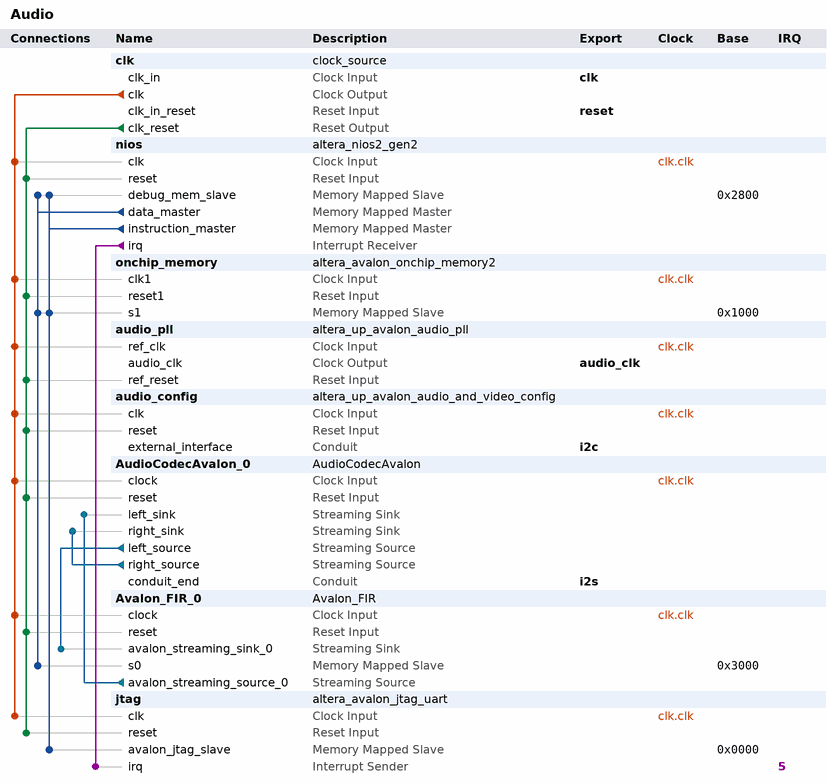
[diagram p0: system contents]
# Platform Designer (Qsys) system Audio, Cyclone V 5CSEMA5F31C6
# Parameters at their usual value, and those the tool derives, are not listed.
package require -exact qsys 16.1
create_system Audio
set_project_property DEVICE_FAMILY {Cyclone V}
set_project_property DEVICE 5CSEMA5F31C6

add_instance clk clock_source 16.1
set_instance_parameter_value clk clockFrequency 50000000

add_instance nios altera_nios2_gen2 16.1
set_instance_parameter_value nios dcache_size 2048
set_instance_parameter_value nios exceptionSlave onchip_memory.s1
set_instance_parameter_value nios icache_size 4096
set_instance_parameter_value nios impl Tiny
set_instance_parameter_value nios resetSlave onchip_memory.s1

add_instance onchip_memory altera_avalon_onchip_memory2 16.1
set_instance_parameter_value onchip_memory dataWidth 32
set_instance_parameter_value onchip_memory dualPort false
set_instance_parameter_value onchip_memory initMemContent true
set_instance_parameter_value onchip_memory initializationFileName onchip_mem.hex
set_instance_parameter_value onchip_memory memorySize 4096

add_instance audio_pll altera_up_avalon_audio_pll 16.1
set_instance_parameter_value audio_pll gui_refclk 50.0

add_instance audio_config altera_up_avalon_audio_and_video_config 16.1
set_instance_parameter_value audio_config audio_in {Line In to ADC}
set_instance_parameter_value audio_config bit_length 24
set_instance_parameter_value audio_config board DE1-SoC
set_instance_parameter_value audio_config line_in_bypass false
set_instance_parameter_value audio_config sampling_rate {48 kHz}

add_instance AudioCodecAvalon_0 AudioCodecAvalon 1.0
set_instance_parameter_value AudioCodecAvalon_0 gDataWidth 24
set_instance_parameter_value AudioCodecAvalon_0 gDataWidthLen 5

add_instance Avalon_FIR_0 Avalon_FIR 1.0
set_instance_parameter_value Avalon_FIR_0 gDataWidth 24
set_instance_parameter_value Avalon_FIR_0 gNrAddressLines 4

add_instance jtag altera_avalon_jtag_uart 16.1
set_instance_parameter_value jtag simInteractiveOptions NO_INTERACTIVE_WINDOWS

# connections
add_connection clk.clk audio_config.clk clock
add_connection clk.clk audio_pll.ref_clk clock
add_connection clk.clk AudioCodecAvalon_0.clock clock
add_connection clk.clk Avalon_FIR_0.clock clock
add_connection clk.clk jtag.clk clock
add_connection clk.clk nios.clk clock
add_connection clk.clk onchip_memory.clk1 clock
add_connection clk.clk_reset audio_config.reset reset
add_connection clk.clk_reset audio_pll.ref_reset reset
add_connection clk.clk_reset AudioCodecAvalon_0.reset reset
add_connection clk.clk_reset Avalon_FIR_0.reset reset
add_connection clk.clk_reset jtag.reset reset
add_connection clk.clk_reset nios.reset reset
add_connection clk.clk_reset onchip_memory.reset1 reset
add_connection nios.data_master Avalon_FIR_0.s0 avalon
set_connection_parameter_value nios.data_master/Avalon_FIR_0.s0 baseAddress 0x3000
add_connection nios.data_master nios.debug_mem_slave avalon
set_connection_parameter_value nios.data_master/nios.debug_mem_slave baseAddress 0x2800
add_connection nios.data_master onchip_memory.s1 avalon
set_connection_parameter_value nios.data_master/onchip_memory.s1 baseAddress 0x1000
add_connection nios.instruction_master jtag.avalon_jtag_slave avalon
set_connection_parameter_value nios.instruction_master/jtag.avalon_jtag_slave baseAddress 0x0000
add_connection nios.instruction_master nios.debug_mem_slave avalon
set_connection_parameter_value nios.instruction_master/nios.debug_mem_slave baseAddress 0x2800
add_connection nios.instruction_master onchip_memory.s1 avalon
set_connection_parameter_value nios.instruction_master/onchip_memory.s1 baseAddress 0x1000
add_connection AudioCodecAvalon_0.left_source Avalon_FIR_0.avalon_streaming_sink_0 avalon_streaming
add_connection AudioCodecAvalon_0.right_source AudioCodecAvalon_0.right_sink avalon_streaming
add_connection Avalon_FIR_0.avalon_streaming_source_0 AudioCodecAvalon_0.left_sink avalon_streaming
add_connection nios.irq jtag.irq interrupt
set_connection_parameter_value nios.irq/jtag.irq irqNumber 5

# exported interfaces
add_interface audio_clk clock source
set_interface_property audio_clk EXPORT_OF audio_pll.audio_clk
add_interface clk clock sink
set_interface_property clk EXPORT_OF clk.clk_in
add_interface i2c conduit end
set_interface_property i2c EXPORT_OF audio_config.external_interface
add_interface i2s conduit end
set_interface_property i2s EXPORT_OF AudioCodecAvalon_0.conduit_end
add_interface reset reset sink
set_interface_property reset EXPORT_OF clk.clk_in_reset

set_interconnect_requirement {$system} qsys_mm.clockCrossingAdapter HANDSHAKE
set_interconnect_requirement {$system} qsys_mm.enableEccProtection FALSE
set_interconnect_requirement {$system} qsys_mm.insertDefaultSlave FALSE
set_interconnect_requirement {$system} qsys_mm.maxAdditionalLatency 1

save_system Audio.qsys
